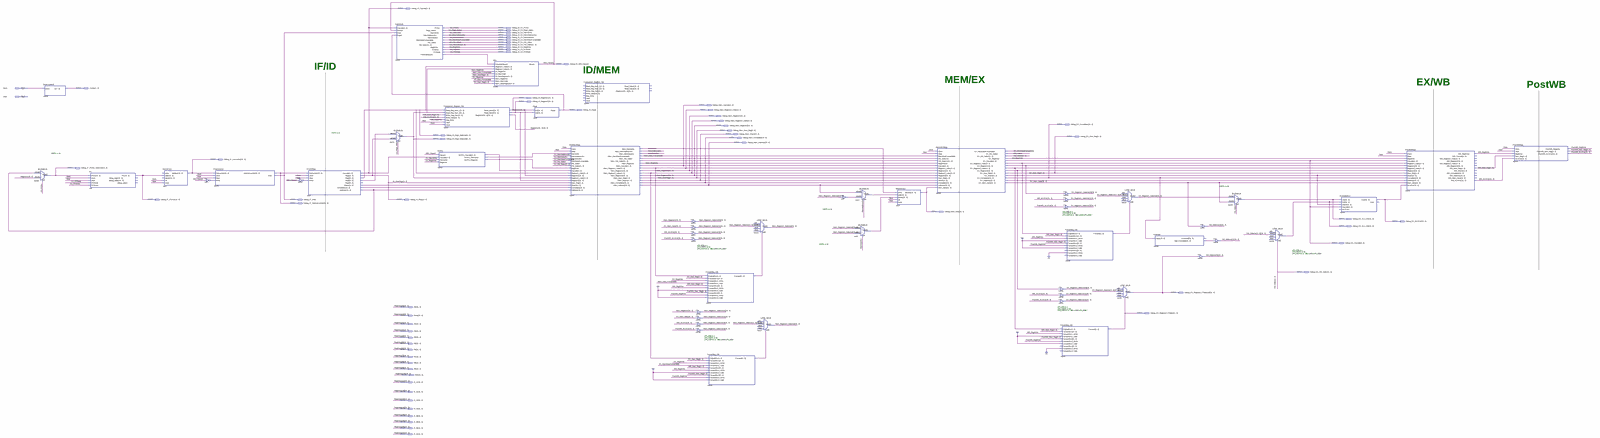
[diagram p0: schematic sheet, whole]
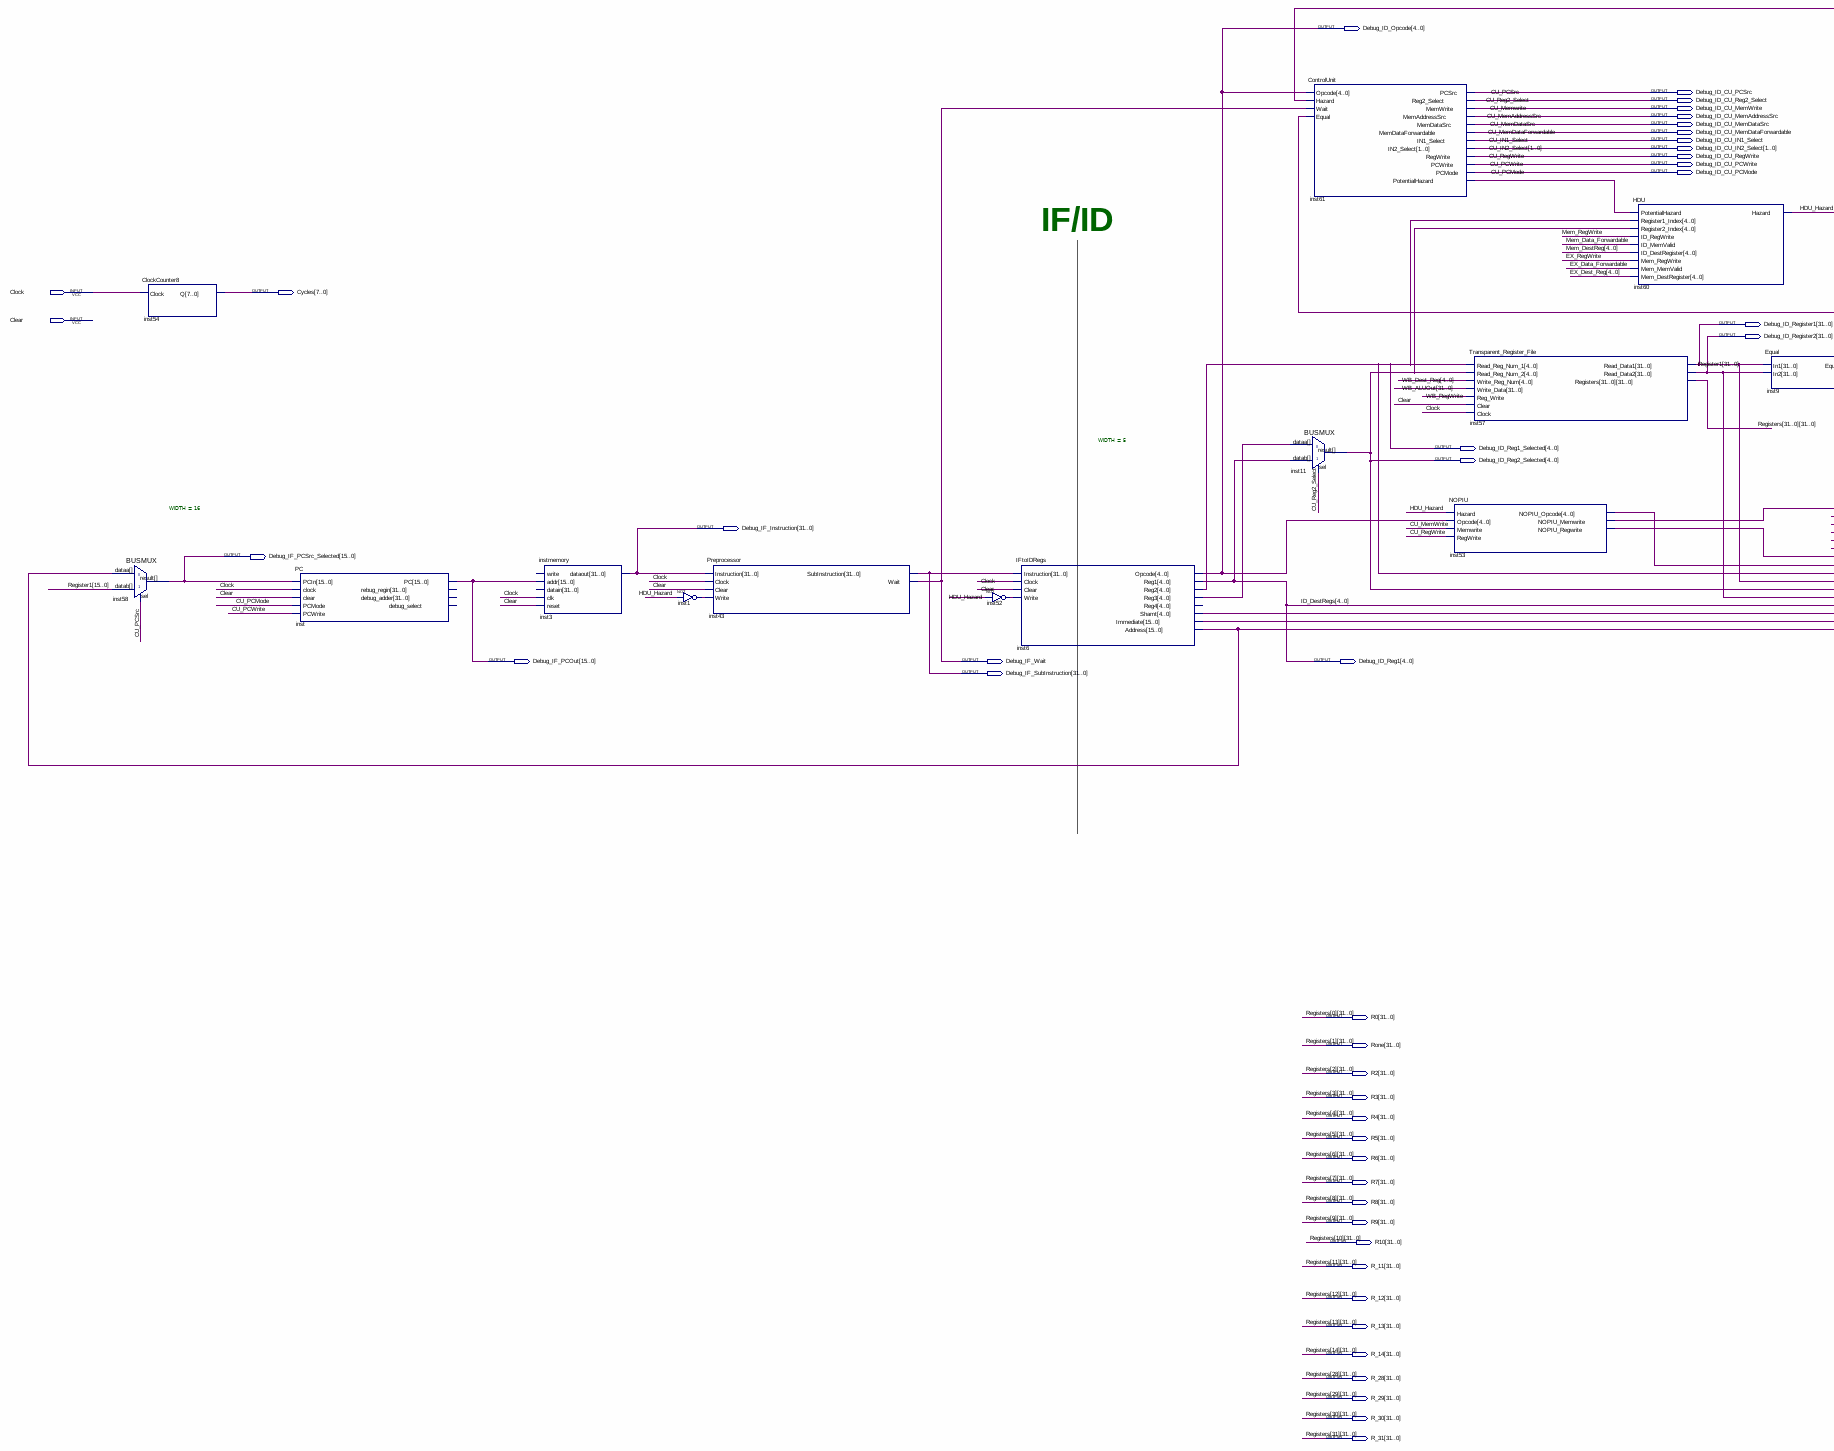
[diagram p1: schematic sheet, left part]
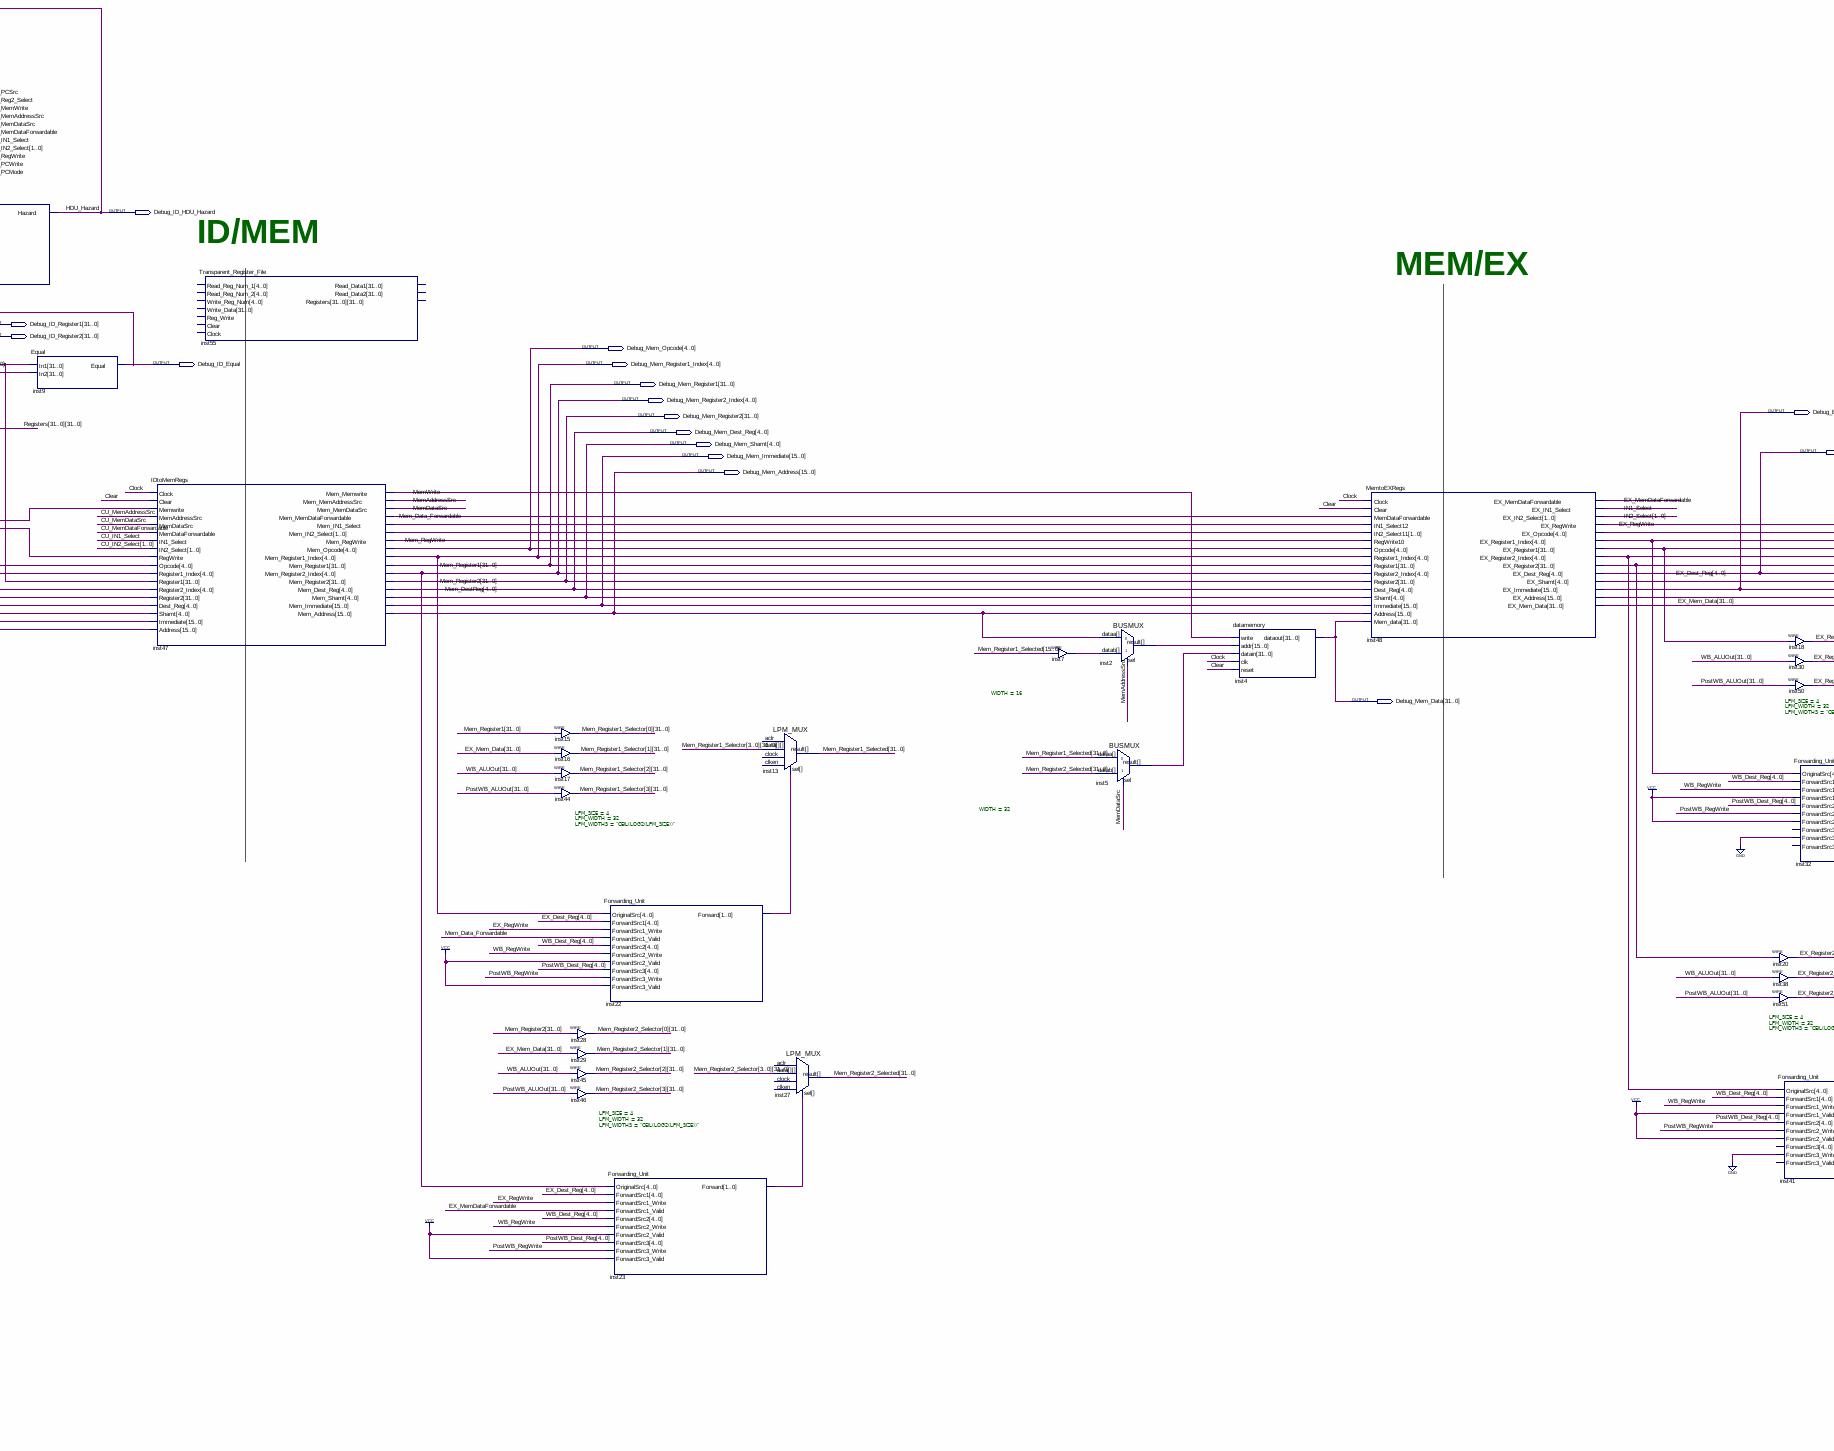
[diagram p2: schematic sheet, centre part]
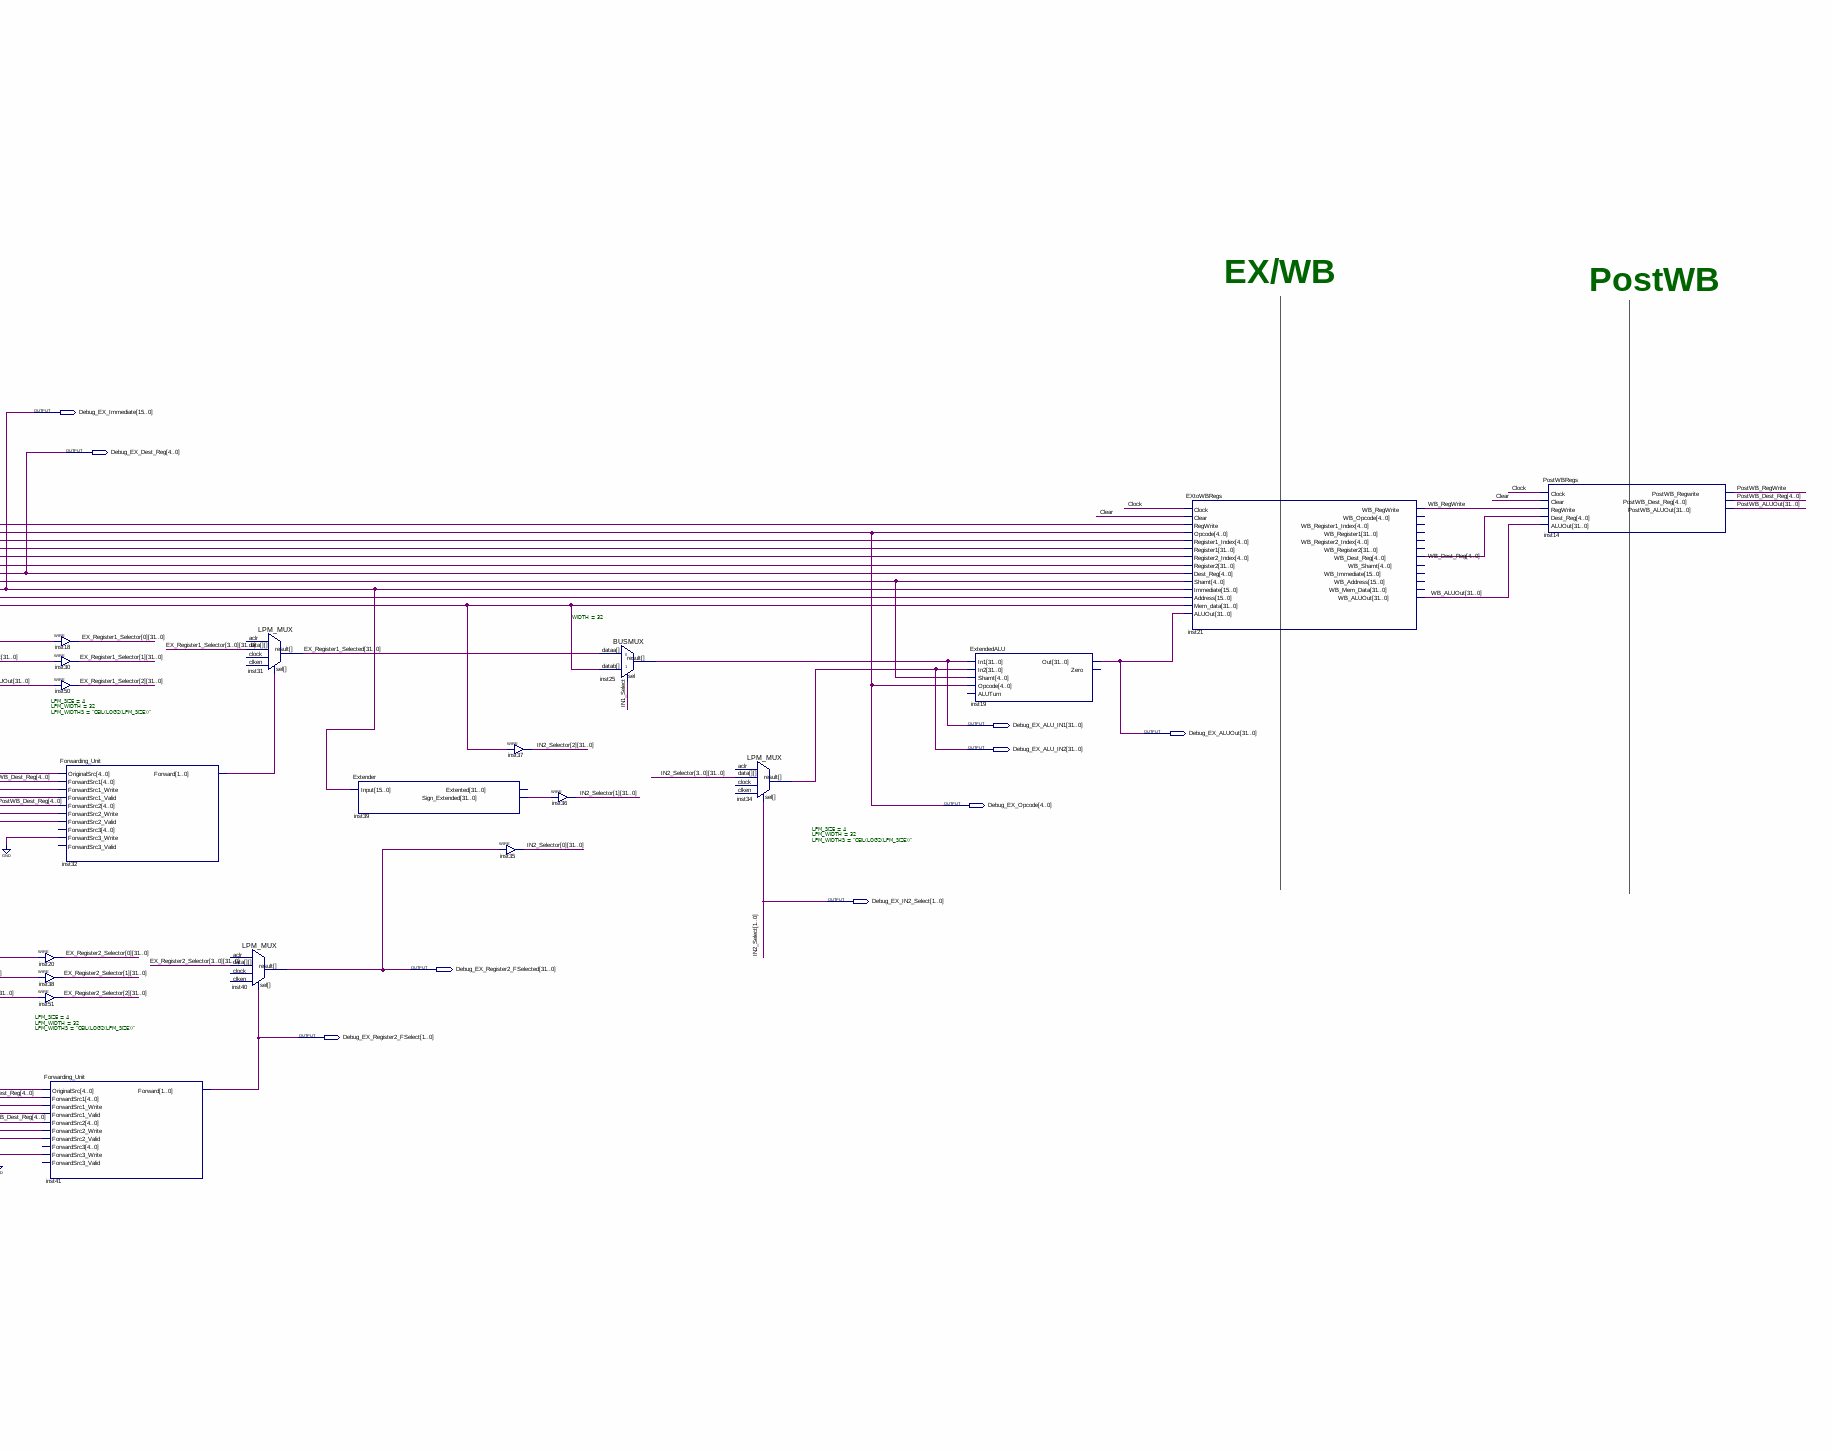
[diagram p3: schematic sheet, right part]
// Quartus schematic DataPath.bdf as structural Verilog: 52 symbols, 65 pins
module DataPath (
  input  Clock,
  input  Clear,
  output [4:0] Debug_ID_Opcode,
  output Debug_ID_CU_PCSrc,
  output Debug_ID_CU_Reg2_Select,
  output Debug_ID_CU_MemWrite,
  output Debug_ID_CU_MemAddressSrc,
  output Debug_ID_CU_MemDataSrc,
  output Debug_ID_CU_MemDataForwardable,
  output Debug_ID_CU_IN1_Select,
  output [1:0] Debug_ID_CU_IN2_Select,
  output Debug_ID_CU_RegWrite,
  output Debug_ID_CU_PCWrite,
  output Debug_ID_CU_PCMode,
  output Debug_ID_HDU_Hazard,
  output [7:0] Cycles,
  output [31:0] Debug_ID_Register1,
  output [31:0] Debug_ID_Register2,
  output [4:0] Debug_Mem_Opcode,
  output Debug_ID_Equal,
  output [4:0] Debug_Mem_Register1_Index,
  output [31:0] Debug_Mem_Register1,
  output [4:0] Debug_Mem_Register2_Index,
  output [15:0] Debug_EX_Immediate,
  output [31:0] Debug_Mem_Register2,
  output [4:0] Debug_Mem_Dest_Reg,
  output [4:0] Debug_Mem_Shamt,
  output [4:0] Debug_ID_Reg1_Selected,
  output [4:0] Debug_EX_Dest_Reg,
  output [15:0] Debug_Mem_Immediate,
  output [4:0] Debug_ID_Reg2_Selected,
  output [15:0] Debug_Mem_Address,
  output [31:0] Debug_IF_Instruction,
  output [15:0] Debug_IF_PCSrc_Selected,
  output [15:0] Debug_IF_PCOut,
  output Debug_IF_Wait,
  output [4:0] Debug_ID_Reg1,
  output [31:0] Debug_IF_SubInstruction,
  output [31:0] Debug_Mem_Data,
  output [31:0] Debug_EX_ALU_IN1,
  output [31:0] Debug_EX_ALUOut,
  output [31:0] Debug_EX_ALU_IN2,
  output [4:0] Debug_EX_Opcode,
  output [1:0] Debug_EX_IN2_Select,
  output [31:0] Debug_EX_Register2_FSelected,
  output [31:0] R0,
  output [1:0] Debug_EX_Register2_FSelect,
  output [31:0] Rone,
  output [31:0] R2,
  output [31:0] R3,
  output [31:0] R4,
  output [31:0] R5,
  output [31:0] R6,
  output [31:0] R7,
  output [31:0] R8,
  output [31:0] R9,
  output [31:0] R10,
  output [31:0] R_11,
  output [31:0] R_12,
  output [31:0] R_13,
  output [31:0] R_14,
  output [31:0] R_28,
  output [31:0] R_29,
  output [31:0] R_30,
  output [31:0] R_31
);

  wire EX_Data_Forwardable, EX_MemDataForwardable, EX_RegWrite, IN1_Select, inst1_out, inst47_mem_in1_select,
       inst52_out, inst53_nopiu_memwrite, inst53_nopiu_regwrite, inst61_potentialhazard,
       Mem_Data_Forwardable, Mem_RegWrite, MemAddressSrc, MemDataSrc, MemWrite, PostWB_RegWrite, WB_RegWrite;
  wire [1:0] inst22_forward, inst23_forward, inst32_forward, inst47_mem_in2_select;
  wire [4:0] inst6_reg3, inst6_shamt, inst48_ex_register1_index, inst48_ex_register2_index, inst48_ex_shamt,
       inst53_nopiu_opcode, PostWB_Dest_Reg, WB_Dest_Reg;
  wire [15:0] inst2_result, inst6_address, inst6_immediate, inst7_out, inst48_ex_address;
  wire [31:0] EX_Mem_Data, EX_Register1_Selected, EX_Register1_Selector_0, EX_Register1_Selector_1,
       EX_Register1_Selector_2, EX_Register1_Selector_3, EX_Register2_Selector_0, EX_Register2_Selector_1,
       EX_Register2_Selector_2, EX_Register2_Selector_3, IN2_Selector_0, IN2_Selector_1, IN2_Selector_2,
       IN2_Selector_3, inst5_result, inst39_sign_extended, inst48_ex_register1, inst48_ex_register2,
       Mem_Register1_Selected, Mem_Register1_Selector_0, Mem_Register1_Selector_1, Mem_Register1_Selector_2,
       Mem_Register1_Selector_3, Mem_Register2_Selected, Mem_Register2_Selector_0, Mem_Register2_Selector_1,
       Mem_Register2_Selector_2, Mem_Register2_Selector_3, PostWB_ALUOut, Registers_15, Registers_16,
       Registers_17, Registers_18, Registers_19, Registers_20, Registers_21, Registers_22, Registers_23,
       Registers_24, Registers_25, Registers_26, Registers_27, WB_ALUOut;

  BUSMUX #(.WIDTH(16)) inst58 (
    .datab(Debug_ID_Register2[15:0]), .sel(Debug_ID_CU_PCSrc), .dataa(inst6_address),
    .result(Debug_IF_PCSrc_Selected));
  ClockCounter8 inst54 (.Clock(Clock), .Q(Cycles));
  PC inst (
    .PCIn(Debug_IF_PCSrc_Selected), .clock(Clock), .clear(Clear), .PCMode(Debug_ID_CU_PCMode),
    .PCWrite(Debug_ID_CU_PCWrite), .PC(Debug_IF_PCOut));  // open: rebug_regin, debug_adder, debug_select
  instmemory inst3 (
    .addr(Debug_IF_PCOut), .clk(Clock), .reset(Clear), .dataout(Debug_IF_Instruction));  // open: write, datain
  not inst1 (inst1_out, Debug_ID_HDU_Hazard);
  Preprocessor inst43 (
    .Instruction(Debug_IF_Instruction), .Clock(Clock), .Clear(Clear), .Write(inst1_out),
    .SubInstruction(Debug_IF_SubInstruction), .Wait(Debug_IF_Wait));
  not inst52 (inst52_out, Debug_ID_HDU_Hazard);
  IFtoIDRegs inst6 (
    .Instruction(Debug_IF_SubInstruction), .Clock(Clock), .Clear(Clear), .Write(inst52_out),
    .Opcode(Debug_ID_Opcode), .Reg1(Debug_ID_Reg1), .Reg2(Debug_ID_Reg1_Selected), .Reg3(inst6_reg3),
    .Shamt(inst6_shamt), .Immediate(inst6_immediate), .Address(inst6_address));  // open: Reg4
  BUSMUX #(.WIDTH(5)) inst11 (
    .datab(Debug_ID_Reg1), .sel(Debug_ID_CU_Reg2_Select), .dataa(inst6_reg3), .result(Debug_ID_Reg2_Selected));
  ControlUnit inst61 (
    .Opcode(Debug_ID_Opcode), .Hazard(Debug_ID_HDU_Hazard), .Wait(Debug_IF_Wait), .Equal(Debug_ID_Equal),
    .PCSrc(Debug_ID_CU_PCSrc), .Reg2_Select(Debug_ID_CU_Reg2_Select), .MemWrite(Debug_ID_CU_MemWrite),
    .MemAddressSrc(Debug_ID_CU_MemAddressSrc), .MemDataSrc(Debug_ID_CU_MemDataSrc),
    .MemDataForwardable(Debug_ID_CU_MemDataForwardable), .IN1_Select(Debug_ID_CU_IN1_Select),
    .IN2_Select(Debug_ID_CU_IN2_Select), .RegWrite(Debug_ID_CU_RegWrite), .PCWrite(Debug_ID_CU_PCWrite),
    .PCMode(Debug_ID_CU_PCMode), .PotentialHazard(inst61_potentialhazard));
  NOPIU inst53 (
    .Hazard(Debug_ID_HDU_Hazard), .Opcode(Debug_ID_Opcode), .Memwrite(Debug_ID_CU_MemWrite),
    .RegWrite(Debug_ID_CU_RegWrite), .NOPIU_Opcode(inst53_nopiu_opcode),
    .NOPIU_Memwrite(inst53_nopiu_memwrite), .NOPIU_Regwrite(inst53_nopiu_regwrite));
  Transparent_Register_File inst57 (
    .Read_Reg_Num_1(Debug_ID_Reg1_Selected), .Read_Reg_Num_2(Debug_ID_Reg2_Selected),
    .Write_Reg_Num(WB_Dest_Reg), .Write_Data(WB_ALUOut), .Reg_Write(WB_RegWrite), .Clear(Clear),
    .Clock(Clock), .Read_Data1(Debug_ID_Register1), .Read_Data2(Debug_ID_Register2),
    .Registers({R_31, R_30, R_29, R_28, Registers_27, Registers_26, Registers_25, Registers_24, Registers_23, Registers_22, Registers_21, Registers_20, Registers_19, Registers_18, Registers_17, Registers_16, Registers_15, R_14, R_13, R_12, R_11, R10, R9, R8, R7, R6, R5, R4, R3, R2, Rone, R0}));
  HDU inst60 (
    .PotentialHazard(inst61_potentialhazard), .Register1_Index(Debug_ID_Reg1_Selected),
    .Register2_Index(Debug_ID_Reg2_Selected), .ID_RegWrite(Mem_RegWrite), .ID_MemValid(Mem_Data_Forwardable),
    .ID_DestRegister(Debug_Mem_Dest_Reg), .Mem_RegWrite(EX_RegWrite), .Mem_MemValid(EX_Data_Forwardable),
    .Mem_DestRegister(Debug_EX_Dest_Reg), .Hazard(Debug_ID_HDU_Hazard));
  Equal inst9 (.In1(Debug_ID_Register1), .In2(Debug_ID_Register2), .Equal(Debug_ID_Equal));
  IDtoMemRegs inst47 (
    .Clock(Clock), .Clear(Clear), .Memwrite(inst53_nopiu_memwrite),
    .MemAddressSrc(Debug_ID_CU_MemAddressSrc), .MemDataSrc(Debug_ID_CU_MemDataSrc),
    .MemDataForwardable(Debug_ID_CU_MemDataForwardable), .IN1_Select(Debug_ID_CU_IN1_Select),
    .IN2_Select(Debug_ID_CU_IN2_Select), .RegWrite(inst53_nopiu_regwrite), .Opcode(inst53_nopiu_opcode),
    .Register1_Index(Debug_ID_Reg1_Selected), .Register1(Debug_ID_Register1),
    .Register2_Index(Debug_ID_Reg2_Selected), .Register2(Debug_ID_Register2), .Dest_Reg(Debug_ID_Reg1),
    .Shamt(inst6_shamt), .Immediate(inst6_immediate), .Address(inst6_address), .Mem_Memwrite(MemWrite),
    .Mem_MemAddressSrc(MemAddressSrc), .Mem_MemDataSrc(MemDataSrc),
    .Mem_MemDataForwardable(Mem_Data_Forwardable), .Mem_IN1_Select(inst47_mem_in1_select),
    .Mem_IN2_Select(inst47_mem_in2_select), .Mem_RegWrite(Mem_RegWrite), .Mem_Opcode(Debug_Mem_Opcode),
    .Mem_Register1_Index(Debug_Mem_Register1_Index), .Mem_Register1(Debug_Mem_Register1),
    .Mem_Register2_Index(Debug_Mem_Register2_Index), .Mem_Register2(Debug_Mem_Register2),
    .Mem_Dest_Reg(Debug_Mem_Dest_Reg), .Mem_Shamt(Debug_Mem_Shamt), .Mem_Immediate(Debug_Mem_Immediate),
    .Mem_Address(Debug_Mem_Address));
  Transparent_Register_File inst55 ();  // open: Read_Reg_Num_1, Read_Reg_Num_2, Write_Reg_Num, Write_Data, Reg_Write, Clear, Clock, Read_Data1, Read_Data2, Registers
  assign Mem_Register1_Selector_0 = Debug_Mem_Register1;  // WIRE inst15
  assign Mem_Register1_Selector_1 = EX_Mem_Data;  // WIRE inst16
  assign Mem_Register1_Selector_2 = WB_ALUOut;  // WIRE inst17
  assign Mem_Register1_Selector_3 = PostWB_ALUOut;  // WIRE inst44
  assign Mem_Register2_Selector_0 = Debug_Mem_Register2;  // WIRE inst28
  assign Mem_Register2_Selector_1 = EX_Mem_Data;  // WIRE inst29
  assign Mem_Register2_Selector_2 = WB_ALUOut;  // WIRE inst45
  assign Mem_Register2_Selector_3 = PostWB_ALUOut;  // WIRE inst46
  Forwarding_Unit inst22 (
    .OriginalSrc(Debug_Mem_Register1_Index), .ForwardSrc1(Debug_EX_Dest_Reg),
    .ForwardSrc1_Write(EX_RegWrite), .ForwardSrc1_Valid(Mem_Data_Forwardable), .ForwardSrc2(WB_Dest_Reg),
    .ForwardSrc2_Write(WB_RegWrite), .ForwardSrc2_Valid(1'b1), .ForwardSrc3(PostWB_Dest_Reg),
    .ForwardSrc3_Write(PostWB_RegWrite), .ForwardSrc3_Valid(1'b1), .Forward(inst22_forward));
  Forwarding_Unit inst23 (
    .OriginalSrc(Debug_Mem_Register2_Index), .ForwardSrc1(Debug_EX_Dest_Reg),
    .ForwardSrc1_Write(EX_RegWrite), .ForwardSrc1_Valid(EX_MemDataForwardable), .ForwardSrc2(WB_Dest_Reg),
    .ForwardSrc2_Write(WB_RegWrite), .ForwardSrc2_Valid(1'b1), .ForwardSrc3(PostWB_Dest_Reg),
    .ForwardSrc3_Write(PostWB_RegWrite), .ForwardSrc3_Valid(1'b1), .Forward(inst23_forward));
  LPM_MUX #(.LPM_SIZE(4), .LPM_WIDTH(32), .LPM_WIDTHS("CEIL(LOG2(LPM_SIZE))")) inst13 (
    .data({Mem_Register1_Selector_3, Mem_Register1_Selector_2, Mem_Register1_Selector_1, Mem_Register1_Selector_0}),
    .sel(inst22_forward), .result(Mem_Register1_Selected));  // open: clock, aclr, clken
  LPM_MUX #(.LPM_SIZE(4), .LPM_WIDTH(32), .LPM_WIDTHS("CEIL(LOG2(LPM_SIZE))")) inst27 (
    .data({Mem_Register2_Selector_3, Mem_Register2_Selector_2, Mem_Register2_Selector_1, Mem_Register2_Selector_0}),
    .sel(inst23_forward), .result(Mem_Register2_Selected));  // open: clock, aclr, clken
  assign inst7_out = Mem_Register1_Selected[15:0];  // WIRE inst7
  BUSMUX #(.WIDTH(16)) inst2 (.datab(inst7_out), .sel(MemAddressSrc), .dataa(Debug_Mem_Address), .result(inst2_result));
  BUSMUX #(.WIDTH(32)) inst5 (
    .datab(Mem_Register2_Selected), .sel(MemDataSrc), .dataa(Mem_Register1_Selected), .result(inst5_result));
  datamemory inst4 (
    .write(MemWrite), .addr(inst2_result), .datain(inst5_result), .clk(Clock), .reset(Clear),
    .dataout(Debug_Mem_Data));
  MemtoEXRegs inst48 (
    .Clock(Clock), .Clear(Clear), .MemDataForwardable(Mem_Data_Forwardable),
    .IN1_Select12(inst47_mem_in1_select), .IN2_Select11(inst47_mem_in2_select), .RegWrite10(Mem_RegWrite),
    .Opcode(Debug_Mem_Opcode), .Register1_Index(Debug_Mem_Register1_Index), .Register1(Debug_Mem_Register1),
    .Register2_Index(Debug_Mem_Register2_Index), .Register2(Debug_Mem_Register2),
    .Dest_Reg(Debug_Mem_Dest_Reg), .Shamt(Debug_Mem_Shamt), .Immediate(Debug_Mem_Immediate),
    .Address(Debug_Mem_Address), .Mem_data(Debug_Mem_Data), .EX_MemDataForwardable(EX_MemDataForwardable),
    .EX_IN1_Select(IN1_Select), .EX_IN2_Select(Debug_EX_IN2_Select), .EX_RegWrite(EX_RegWrite),
    .EX_Opcode(Debug_EX_Opcode), .EX_Register1_Index(inst48_ex_register1_index),
    .EX_Register1(inst48_ex_register1), .EX_Register2_Index(inst48_ex_register2_index),
    .EX_Register2(inst48_ex_register2), .EX_Dest_Reg(Debug_EX_Dest_Reg), .EX_Shamt(inst48_ex_shamt),
    .EX_Immediate(Debug_EX_Immediate), .EX_Address(inst48_ex_address), .EX_Mem_Data(EX_Mem_Data));
  assign EX_Register2_Selector_0 = inst48_ex_register2;  // WIRE inst20
  assign EX_Register2_Selector_1 = WB_ALUOut;  // WIRE inst38
  assign EX_Register2_Selector_2 = PostWB_ALUOut;  // WIRE inst51
  Forwarding_Unit inst41 (
    .OriginalSrc(inst48_ex_register2_index), .ForwardSrc1(WB_Dest_Reg), .ForwardSrc1_Write(WB_RegWrite),
    .ForwardSrc1_Valid(1'b1), .ForwardSrc2(PostWB_Dest_Reg), .ForwardSrc2_Write(PostWB_RegWrite),
    .ForwardSrc2_Valid(1'b1), .ForwardSrc3_Write(1'b0), .Forward(Debug_EX_Register2_FSelect));  // open: ForwardSrc3, ForwardSrc3_Valid
  assign EX_Register1_Selector_0 = inst48_ex_register1;  // WIRE inst18
  assign EX_Register1_Selector_1 = WB_ALUOut;  // WIRE inst30
  assign EX_Register1_Selector_2 = PostWB_ALUOut;  // WIRE inst50
  Forwarding_Unit inst32 (
    .OriginalSrc(inst48_ex_register1_index), .ForwardSrc1(WB_Dest_Reg), .ForwardSrc1_Write(WB_RegWrite),
    .ForwardSrc1_Valid(1'b1), .ForwardSrc2(PostWB_Dest_Reg), .ForwardSrc2_Write(PostWB_RegWrite),
    .ForwardSrc2_Valid(1'b1), .ForwardSrc3_Write(1'b0), .Forward(inst32_forward));  // open: ForwardSrc3, ForwardSrc3_Valid
  LPM_MUX #(.LPM_SIZE(4), .LPM_WIDTH(32), .LPM_WIDTHS("CEIL(LOG2(LPM_SIZE))")) inst40 (
    .data({EX_Register2_Selector_3, EX_Register2_Selector_2, EX_Register2_Selector_1, EX_Register2_Selector_0}),
    .sel(Debug_EX_Register2_FSelect), .result(Debug_EX_Register2_FSelected));  // open: clock, aclr, clken
  LPM_MUX #(.LPM_SIZE(4), .LPM_WIDTH(32), .LPM_WIDTHS("CEIL(LOG2(LPM_SIZE))")) inst31 (
    .data({EX_Register1_Selector_3, EX_Register1_Selector_2, EX_Register1_Selector_1, EX_Register1_Selector_0}),
    .sel(inst32_forward), .result(EX_Register1_Selected));  // open: clock, aclr, clken
  Extender inst39 (.Input(Debug_EX_Immediate), .Sign_Extended(inst39_sign_extended));  // open: Extented
  assign IN2_Selector_2 = EX_Mem_Data;  // WIRE inst37
  assign IN2_Selector_0 = Debug_EX_Register2_FSelected;  // WIRE inst35
  assign IN2_Selector_1 = inst39_sign_extended;  // WIRE inst36
  BUSMUX #(.WIDTH(32)) inst25 (
    .datab(EX_Mem_Data), .sel(IN1_Select), .dataa(EX_Register1_Selected), .result(Debug_EX_ALU_IN1));
  LPM_MUX #(.LPM_SIZE(4), .LPM_WIDTH(32), .LPM_WIDTHS("CEIL(LOG2(LPM_SIZE))")) inst34 (
    .data({IN2_Selector_3, IN2_Selector_2, IN2_Selector_1, IN2_Selector_0}), .sel(Debug_EX_IN2_Select),
    .result(Debug_EX_ALU_IN2));  // open: clock, aclr, clken
  ExtendedALU inst19 (
    .In1(Debug_EX_ALU_IN1), .In2(Debug_EX_ALU_IN2), .Shamt(inst48_ex_shamt), .Opcode(Debug_EX_Opcode),
    .Out(Debug_EX_ALUOut));  // open: ALUTurn, Zero
  EXtoWBRegs inst21 (
    .Clock(Clock), .Clear(Clear), .RegWrite(EX_RegWrite), .Opcode(Debug_EX_Opcode),
    .Register1_Index(inst48_ex_register1_index), .Register1(inst48_ex_register1),
    .Register2_Index(inst48_ex_register2_index), .Register2(inst48_ex_register2),
    .Dest_Reg(Debug_EX_Dest_Reg), .Shamt(inst48_ex_shamt), .Immediate(Debug_EX_Immediate),
    .Address(inst48_ex_address), .Mem_data(EX_Mem_Data), .ALUOut(Debug_EX_ALUOut), .WB_RegWrite(WB_RegWrite),
    .WB_Dest_Reg(WB_Dest_Reg), .WB_ALUOut(WB_ALUOut));  // open: WB_Opcode, WB_Register1_Index, WB_Register1, WB_Register2_Index, WB_Register2, WB_Shamt, WB_Immediate, WB_Address, WB_Mem_Data
  PostWBRegs inst14 (
    .Clock(Clock), .Clear(Clear), .RegWrite(WB_RegWrite), .Dest_Reg(WB_Dest_Reg), .ALUOut(WB_ALUOut),
    .PostWB_Regwrite(PostWB_RegWrite), .PostWB_Dest_Reg(PostWB_Dest_Reg), .PostWB_ALUOut(PostWB_ALUOut));

  // Other names for the same wires on the sheet: CU_IN1_Select = Debug_ID_CU_IN1_Select;
  //   CU_IN2_Select[1:0] = Debug_ID_CU_IN2_Select; CU_MemAddressSrc = Debug_ID_CU_MemAddressSrc;
  //   CU_MemDataForwardable = Debug_ID_CU_MemDataForwardable; CU_MemDataSrc = Debug_ID_CU_MemDataSrc;
  //   CU_MemWrite = Debug_ID_CU_MemWrite; CU_PCMode = Debug_ID_CU_PCMode; CU_PCSrc = Debug_ID_CU_PCSrc;
  //   CU_PCWrite = Debug_ID_CU_PCWrite; CU_Reg2_Select = Debug_ID_CU_Reg2_Select; CU_RegWrite = Debug_ID_CU_RegWrite;
  //   IN2_Select[1:0] = Debug_EX_IN2_Select; ID_DestRegs[4:0] = Debug_ID_Reg1; Register1[31:0] = Debug_ID_Register2;
  //   EX_Dest_Reg[4:0] = Debug_EX_Dest_Reg; HDU_Hazard = Debug_ID_HDU_Hazard; Mem_DestReg[4:0] = Debug_Mem_Dest_Reg;
  //   Mem_Register1[31:0] = Debug_Mem_Register1; Mem_Register2[31:0] = Debug_Mem_Register2; Registers_0[31:0] = R0;
  //   Registers_1[31:0] = Rone; Registers_2[31:0] = R2; Registers_3[31:0] = R3; Registers_4[31:0] = R4;
  //   Registers_5[31:0] = R5; Registers_6[31:0] = R6; Registers_7[31:0] = R7; Registers_8[31:0] = R8;
  //   Registers_9[31:0] = R9; Registers_10[31:0] = R10; Registers_11[31:0] = R_11; Registers_12[31:0] = R_12;
  //   Registers_13[31:0] = R_13; Registers_14[31:0] = R_14; Registers_28[31:0] = R_28; Registers_29[31:0] = R_29;
  //   Registers_30[31:0] = R_30; Registers_31[31:0] = R_31

  // Notes on the sheet:
  //   IF/ID
  //   ID/MEM
  //   MEM/EX
  //   EX/WB
  //   PostWB
endmodule
